# Altium project STM32_PLC.PrjPcb (part 2 of 2)

## Sheet 09_CAN.SchDoc
size 420 x 297 mm; SheetNumber: 9; SheetTotal: 12
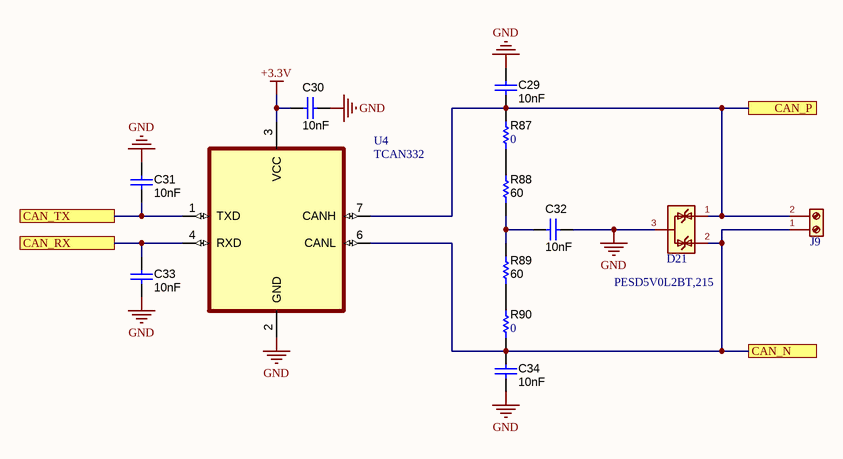
[diagram p4: 09_CAN.SchDoc]

### Parts
C29  ValueDisplayed: 10nF  [0603]  (hidden comment: CAP 10nF 0603)
C30  ValueDisplayed: 10nF  [0603]  (hidden comment: CAP 10nF 0603)
C31  ValueDisplayed: 10nF  [0603]  (hidden comment: CAP 10nF 0603)
C32  ValueDisplayed: 10nF  [0603]  (hidden comment: CAP 10nF 0603)
C33  ValueDisplayed: 10nF  [0603]  (hidden comment: CAP 10nF 0603)
C34  ValueDisplayed: 10nF  [0603]  (hidden comment: CAP 10nF 0603)
D21  PESD5V0L2BT,215  [SOT-23]
J9  Terminal_01x02_P5.00  [TerminalBlock_Phoenix_PT-1,5-2-5.0-H_1x02_P5.00mm_Horizontal]  (value not drawn)
R87  ValueDisplayed: 0  [0402L]  (hidden comment: ERJ-2GE0R00X)
R88  ValueDisplayed: 60  [0603]  (hidden comment: MCT06030Z0000ZP500)
R89  ValueDisplayed: 60  [0603]  (hidden comment: MCT06030Z0000ZP500)
R90  ValueDisplayed: 0  [0402L]  (hidden comment: ERJ-2GE0R00X)
U4  TCAN332  [SOIC127P599X175-8N]

### Ports
CAN_N, CAN_P, CAN_RX (see 04_STM32F373VBTx[6B]), CAN_TX (see 04_STM32F373VBTx[6B])

### Nets
+3.3V: C30.2 U4.3(VCC)
GND: C29.1 C30.1 C31.1 C32.1 C33.2 C34.2 D21.3(A) U4.2(GND)
CAN_N: C34.1 D21.2(K) J9.1(Pin_1) R90.1 U4.6(CANL) ; port CAN_N
CAN_P: C29.2 D21.1(K) J9.2(Pin_2) R87.2 U4.7(CANH) ; port CAN_P
CAN_RX: C33.1 U4.4(RXD) ; port CAN_RX
CAN_TX: C31.2 U4.1(TXD) ; port CAN_TX
NetC32_2: C32.2 R88.1 R89.2
NetR87_1: R87.1 R88.2
NetR89_1: R89.1 R90.2

### Notes on the sheet
- Sub-system:
- Project:
- Design by:
- Sheet title:
- Sheet
- of
- Checked by:
- Approved by:
- Doc No:
- Revision:
- Size:
- Date:
- A3

### Library data of the parts
C29-C34 = CAP 10nF 0603: CAP, CERM, 10 nF, 50 V, +/- 10%, X7R, AEC-Q200 Grade 1, 0603; Manufacturer: MuRata; PartNumber: GCM188R70J225KE22D; TaMin_C: -55°C; Polarized: N; SizeAreaWB_mm2: 4.68; Value1: Unknown; U/M: EA; Value: 2.2uF; TaMax_C: 125°C; SizeZ_mm: 1; SizeX_mm: 1.6; SizeY_mm: 0.8; Value2: 6.3V; SizeArea_mm2: 1.28; CompType: Capacitor; AEC Qualified: Y; Cap_F: 2.2µF; AEC Category: Q200; Supplier Part Number 2: 81-GCM188R70J225KE2D; Publisher: Texas Instruments; Supplier 2: Mouser; TempCo: X7R; Published: 2008-06-19; RoHS: Y; MountType: SMT; Supplier 1: Digi-Key; PackageReference: 0603; Tolerance_%: 10%; Cap_Case: 0603; LatestRevisionDate: 2017-03-09; VDC_V: 6.3V; ComponentLink1Description: Datasheet link; AEC Grade: 1; Supplier Part Number 1: 490-5316-1-ND; Technology: Ceramic; ComponentLink1URL: http://psearch.en.murata.com/capacitor/product/GCM188R70J225KE22%23.pdf
R87 R90 = RES 0R 0402 0.1W: RES, 0, 5%, 0.1 W, AEC-Q200 Grade 0, 0402; Manufacturer: Panasonic; Power_W: 100mW; TempCo: 600 ppm/C; Value_Code: 0000; Value: 0; EIA_Code: E24; SizeX_mm: 1; SizeY_mm: 0.5; SizeZ_mm: 0.6; Value2: 0.1W; CompType: Resistor; AEC Qualified: Y; VDC_V: 50V; AEC Category: Q200; SizeAreaWB_mm2: 3; Supplier Part Number 2: 65T8307; Supplier 2: Newark; Supplier Part Number 3: 667-ERJ-2GE0R00X; Supplier 3: Mouser; RoHS: Y; Value1: 5%; MountType: SMT; Supplier 1: Digi-Key; PackageReference: 0402; Tolerance_%: 5%; Res_ohm: 0; SizeArea_mm2: 0.5; PartNumber: ERJ-2GE0R00X; ComponentLink1Description: Datasheet link; Supplier Part Number 1: P0.0JCT-ND; Technology: Thick Film; ComponentLink1URL: https://industrial.panasonic.com/cdbs/www-data/pdf/RDA0000/AOA0000C301.pdf; AEC Grade: 0
R88 R89 = RES 60R 0603: RES, 60, 5%, 0.125 W, 0603; Manufacturer: Vishay/Beyschlag; Power_W: 125mW; TempCo: ppm/C; Value_Code: 0000; U/M: EA; Value: 0; EIA_Code: E24; SizeX_mm: 1.6; SizeY_mm: 0.8; SizeZ_mm: 1; Value2: 0.125W; SizeArea_mm2: 1.28; CompType: Resistor; AEC Qualified: N; AEC Category: Q200; Supplier Part Number 2: 96Y9454; Publisher: Texas Instruments; Supplier 2: Newark; Supplier Part Number 3: 594-MCT06030Z0000ZP5; Supplier 3: Mouser; Published: 2008-06-26; RoHS: Y; Value1: 5%; MountType: SMT; Supplier 1: Digi-Key; PackageReference: 0603; Tolerance_%: 5%; Res_ohm: 0; LatestRevisionDate: 2017-03-09; PartNumber: MCT06030Z0000ZP500; ComponentLink1Description: Datasheet link; AEC Grade: N/A; Supplier Part Number 1: MCT0603-0.0-ZZCT-ND; Technology: Thin Film; ComponentLink1URL: http://www.vishay.com/docs/28705/mcx0x0xpro.pdf
U4 = TCAN332DR: 3.3-V CAN Transceivers; MF: Texas Instruments; SnapEDA_Link: https://www.snapeda.com/parts/TCAN332DR/Texas+Instruments/view-part/?ref=snap; Package: SOIC-8 Texas Instruments; Value: *; MP: TCAN332DR; Check_prices: https://www.snapeda.com/parts/TCAN332DR/Texas+Instruments/view-part/?ref=eda

## Sheet 10_SDADC.SchDoc
size 420 x 297 mm; SheetNumber: 10; SheetTotal: 12
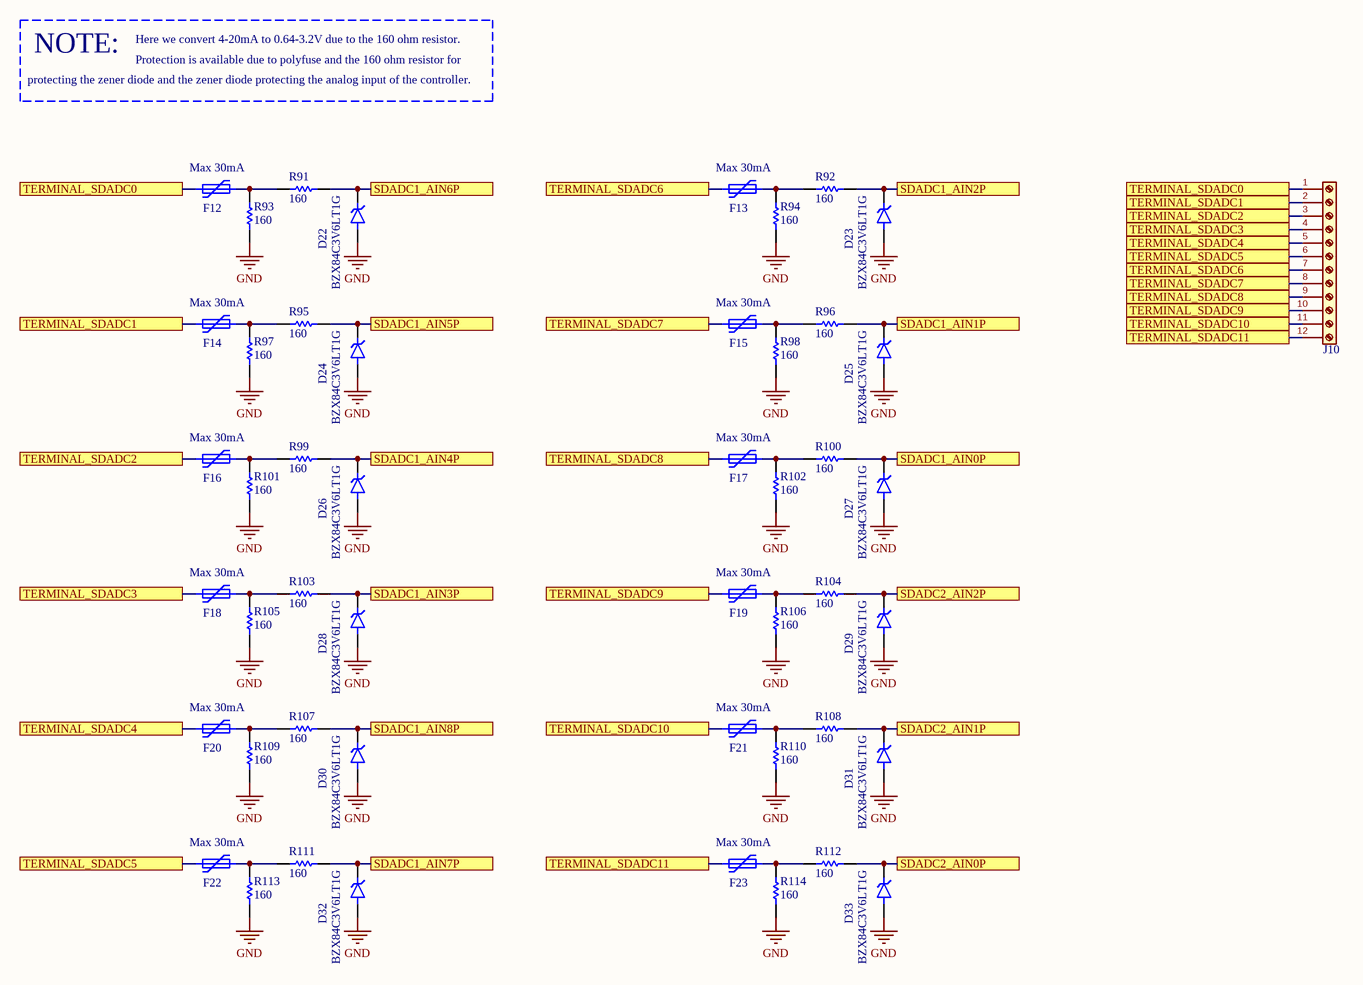
[diagram p5: 10_SDADC.SchDoc]

### Parts
D22  BZX84C3V6LT1G  [SOT95P240X111-3N]
D23  BZX84C3V6LT1G  [SOT95P240X111-3N]
D24  BZX84C3V6LT1G  [SOT95P240X111-3N]
D25  BZX84C3V6LT1G  [SOT95P240X111-3N]
D26  BZX84C3V6LT1G  [SOT95P240X111-3N]
D27  BZX84C3V6LT1G  [SOT95P240X111-3N]
D28  BZX84C3V6LT1G  [SOT95P240X111-3N]
D29  BZX84C3V6LT1G  [SOT95P240X111-3N]
D30  BZX84C3V6LT1G  [SOT95P240X111-3N]
D31  BZX84C3V6LT1G  [SOT95P240X111-3N]
D32  BZX84C3V6LT1G  [SOT95P240X111-3N]
D33  BZX84C3V6LT1G  [SOT95P240X111-3N]
F12  Max 30mA  [Fuse_0603_1608Metric]
F13  Max 30mA  [Fuse_0603_1608Metric]
F14  Max 30mA  [Fuse_0603_1608Metric]
F15  Max 30mA  [Fuse_0603_1608Metric]
F16  Max 30mA  [Fuse_0603_1608Metric]
F17  Max 30mA  [Fuse_0603_1608Metric]
F18  Max 30mA  [Fuse_0603_1608Metric]
F19  Max 30mA  [Fuse_0603_1608Metric]
F20  Max 30mA  [Fuse_0603_1608Metric]
F21  Max 30mA  [Fuse_0603_1608Metric]
F22  Max 30mA  [Fuse_0603_1608Metric]
F23  Max 30mA  [Fuse_0603_1608Metric]
J10  Terminal_01x12_P5.00  [TerminalBlock_Phoenix_PT-1,5-12-5.0-H_1x12_P5.00mm_Horizontal]  (value not drawn)
R91  ValueDisplayed: 160  [0603]  (hidden comment: CRCW060320R0JNEA)
R92  ValueDisplayed: 160  [0603]  (hidden comment: CRCW060320R0JNEA)
R93  ValueDisplayed: 160  [0603]  (hidden comment: CRCW060320R0JNEA)
R94  ValueDisplayed: 160  [0603]  (hidden comment: CRCW060320R0JNEA)
R95  ValueDisplayed: 160  [0603]  (hidden comment: CRCW060320R0JNEA)
R96  ValueDisplayed: 160  [0603]  (hidden comment: CRCW060320R0JNEA)
R97  ValueDisplayed: 160  [0603]  (hidden comment: CRCW060320R0JNEA)
R98  ValueDisplayed: 160  [0603]  (hidden comment: CRCW060320R0JNEA)
R99  ValueDisplayed: 160  [0603]  (hidden comment: CRCW060320R0JNEA)
R100  ValueDisplayed: 160  [0603]  (hidden comment: CRCW060320R0JNEA)
R101  ValueDisplayed: 160  [0603]  (hidden comment: CRCW060320R0JNEA)
R102  ValueDisplayed: 160  [0603]  (hidden comment: CRCW060320R0JNEA)
R103  ValueDisplayed: 160  [0603]  (hidden comment: CRCW060320R0JNEA)
R104  ValueDisplayed: 160  [0603]  (hidden comment: CRCW060320R0JNEA)
R105  ValueDisplayed: 160  [0603]  (hidden comment: CRCW060320R0JNEA)
R106  ValueDisplayed: 160  [0603]  (hidden comment: CRCW060320R0JNEA)
R107  ValueDisplayed: 160  [0603]  (hidden comment: CRCW060320R0JNEA)
R108  ValueDisplayed: 160  [0603]  (hidden comment: CRCW060320R0JNEA)
R109  ValueDisplayed: 160  [0603]  (hidden comment: CRCW060320R0JNEA)
R110  ValueDisplayed: 160  [0603]  (hidden comment: CRCW060320R0JNEA)
R111  ValueDisplayed: 160  [0603]  (hidden comment: CRCW060320R0JNEA)
R112  ValueDisplayed: 160  [0603]  (hidden comment: CRCW060320R0JNEA)
R113  ValueDisplayed: 160  [0603]  (hidden comment: CRCW060320R0JNEA)
R114  ValueDisplayed: 160  [0603]  (hidden comment: CRCW060320R0JNEA)

### Ports
SDADC1_AIN0P (see 04_STM32F373VBTx[5C]), SDADC1_AIN1P (see 04_STM32F373VBTx[5C]), SDADC1_AIN2P (see 04_STM32F373VBTx[5C]), SDADC1_AIN3P (see 04_STM32F373VBTx[5C]), SDADC1_AIN4P (see 04_STM32F373VBTx[6B]), SDADC1_AIN5P (see 04_STM32F373VBTx[6B]), SDADC1_AIN6P (see 04_STM32F373VBTx[6B]), SDADC1_AIN7P (see 04_STM32F373VBTx[5C]), SDADC1_AIN8P (see 04_STM32F373VBTx[5C]), SDADC2_AIN0P (see 04_STM32F373VBTx[5C]), SDADC2_AIN1P (see 04_STM32F373VBTx[5C]), SDADC2_AIN2P (see 04_STM32F373VBTx[5C]), TERMINAL_SDADC0 (see 10_SDADC[1A]), TERMINAL_SDADC0 (see 10_SDADC[4A]), TERMINAL_SDADC1 (see 10_SDADC[1A]), TERMINAL_SDADC1 (see 10_SDADC[4A]), TERMINAL_SDADC2 (see 10_SDADC[1B]), TERMINAL_SDADC2 (see 10_SDADC[4A]), TERMINAL_SDADC3 (see 10_SDADC[1B]), TERMINAL_SDADC3 (see 10_SDADC[4A]), TERMINAL_SDADC4 (see 10_SDADC[1B]), TERMINAL_SDADC4 (see 10_SDADC[4A]), TERMINAL_SDADC5 (see 10_SDADC[1C]), TERMINAL_SDADC5 (see 10_SDADC[4A]), TERMINAL_SDADC6 (see 10_SDADC[2A]), TERMINAL_SDADC6 (see 10_SDADC[4A]), TERMINAL_SDADC7 (see 10_SDADC[2A]), TERMINAL_SDADC7 (see 10_SDADC[4A]), TERMINAL_SDADC8 (see 10_SDADC[2B]), TERMINAL_SDADC8 (see 10_SDADC[4A]), TERMINAL_SDADC9 (see 10_SDADC[2B]), TERMINAL_SDADC9 (see 10_SDADC[4A]), TERMINAL_SDADC10 (see 10_SDADC[2B]), TERMINAL_SDADC10 (see 10_SDADC[4A]), TERMINAL_SDADC11 (see 10_SDADC[2C]), TERMINAL_SDADC11 (see 10_SDADC[4A])

### Nets
GND: D22.1(A) D23.1(A) D24.1(A) D25.1(A) D26.1(A) D27.1(A) D28.1(A) D29.1(A) D30.1(A) D31.1(A) D32.1(A) D33.1(A) R93.1 R94.1 R97.1 R98.1 R101.1 R102.1 R105.1 R106.1 R109.1 R110.1 R113.1 R114.1
SDADC1_AIN0P: D27.3(K) R100.2 ; port SDADC1_AIN0P
SDADC1_AIN1P: D25.3(K) R96.2 ; port SDADC1_AIN1P
SDADC1_AIN2P: D23.3(K) R92.2 ; port SDADC1_AIN2P
SDADC1_AIN3P: D28.3(K) R103.2 ; port SDADC1_AIN3P
SDADC1_AIN4P: D26.3(K) R99.2 ; port SDADC1_AIN4P
SDADC1_AIN5P: D24.3(K) R95.2 ; port SDADC1_AIN5P
SDADC1_AIN6P: D22.3(K) R91.2 ; port SDADC1_AIN6P
SDADC1_AIN7P: D32.3(K) R111.2 ; port SDADC1_AIN7P
SDADC1_AIN8P: D30.3(K) R107.2 ; port SDADC1_AIN8P
SDADC2_AIN0P: D33.3(K) R112.2 ; port SDADC2_AIN0P
SDADC2_AIN1P: D31.3(K) R108.2 ; port SDADC2_AIN1P
SDADC2_AIN2P: D29.3(K) R104.2 ; port SDADC2_AIN2P
TERMINAL_SDADC0: F12.1 J10.1(Pin_1) ; port TERMINAL_SDADC0
TERMINAL_SDADC1: F14.1 J10.2(Pin_2) ; port TERMINAL_SDADC1
TERMINAL_SDADC2: F16.1 J10.3(Pin_3) ; port TERMINAL_SDADC2
TERMINAL_SDADC3: F18.1 J10.4(Pin_4) ; port TERMINAL_SDADC3
TERMINAL_SDADC4: F20.1 J10.5(Pin_5) ; port TERMINAL_SDADC4
TERMINAL_SDADC5: F22.1 J10.6(Pin_6) ; port TERMINAL_SDADC5
TERMINAL_SDADC6: F13.1 J10.7(Pin_7) ; port TERMINAL_SDADC6
TERMINAL_SDADC7: F15.1 J10.8(Pin_8) ; port TERMINAL_SDADC7
TERMINAL_SDADC8: F17.1 J10.9(Pin_9) ; port TERMINAL_SDADC8
TERMINAL_SDADC9: F19.1 J10.10(Pin_10) ; port TERMINAL_SDADC9
TERMINAL_SDADC10: F21.1 J10.11(Pin_11) ; port TERMINAL_SDADC10
TERMINAL_SDADC11: F23.1 J10.12(Pin_12) ; port TERMINAL_SDADC11
NetF12_2: F12.2 R91.1 R93.2
NetF13_2: F13.2 R92.1 R94.2
NetF14_2: F14.2 R95.1 R97.2
NetF15_2: F15.2 R96.1 R98.2
NetF16_2: F16.2 R99.1 R101.2
NetF17_2: F17.2 R100.1 R102.2
NetF18_2: F18.2 R103.1 R105.2
NetF19_2: F19.2 R104.1 R106.2
NetF20_2: F20.2 R107.1 R109.2
NetF21_2: F21.2 R108.1 R110.2
NetF22_2: F22.2 R111.1 R113.2
NetF23_2: F23.2 R112.1 R114.2

### Notes on the sheet
- protecting the zener diode and the zener diode protecting the analog input of the controller.
- NOTE:
- Here we convert 4-20mA to 0.64-3.2V due to the 160 ohm resistor.
- Protection is available due to polyfuse and the 160 ohm resistor for
- Sub-system:
- Project:
- Design by:
- Sheet title:
- Sheet
- of
- Checked by:
- Approved by:
- Doc No:
- Revision:
- Size:
- Date:
- A3

### Library data of the parts
D22-D33 = BZX84C3V6LT1G: MP: BZX84C10LT1G; Package: None; Price: None; Value: *; Availability: Unavailable
F12-F23 = Polyfuse 0603
R91-R114 = RES 160R 0603: RES, 160, 5%, 0.1 W, AEC-Q200 Grade 0, 0603; Manufacturer: Vishay-Dale; Power_W: 100mW; TempCo: 200 ppm/C; Value_Code: 20R0; Value: 20; EIA_Code: E24; SizeX_mm: 1.6; SizeY_mm: 0.8; SizeZ_mm: 1; Value2: 0.1W; SizeArea_mm2: 1.28; CompType: Resistor; AEC Qualified: Y; VDC_V: 75V; AEC Category: Q200; AEC Grade: 0; Supplier Part Number 2: 59M6784; Supplier 2: Newark; Supplier Part Number 3: 71-CRCW0603J-20-E3; Supplier 3: Mouser; RoHS: E; Value1: 5%; MountType: SMT; Supplier 1: Digi-Key; PackageReference: 0603; Tolerance_%: 5%; Res_ohm: 20; PartNumber: CRCW060320R0JNEA; ComponentLink1Description: Datasheet link; Supplier Part Number 1: 541-20GCT-ND; Technology: Thick Film; ComponentLink1URL: http://www.vishay.com/docs/20035/dcrcwe3.pdf

## Sheet 11_DAC.SchDoc
size 420 x 297 mm; SheetNumber: 11; SheetTotal: 12
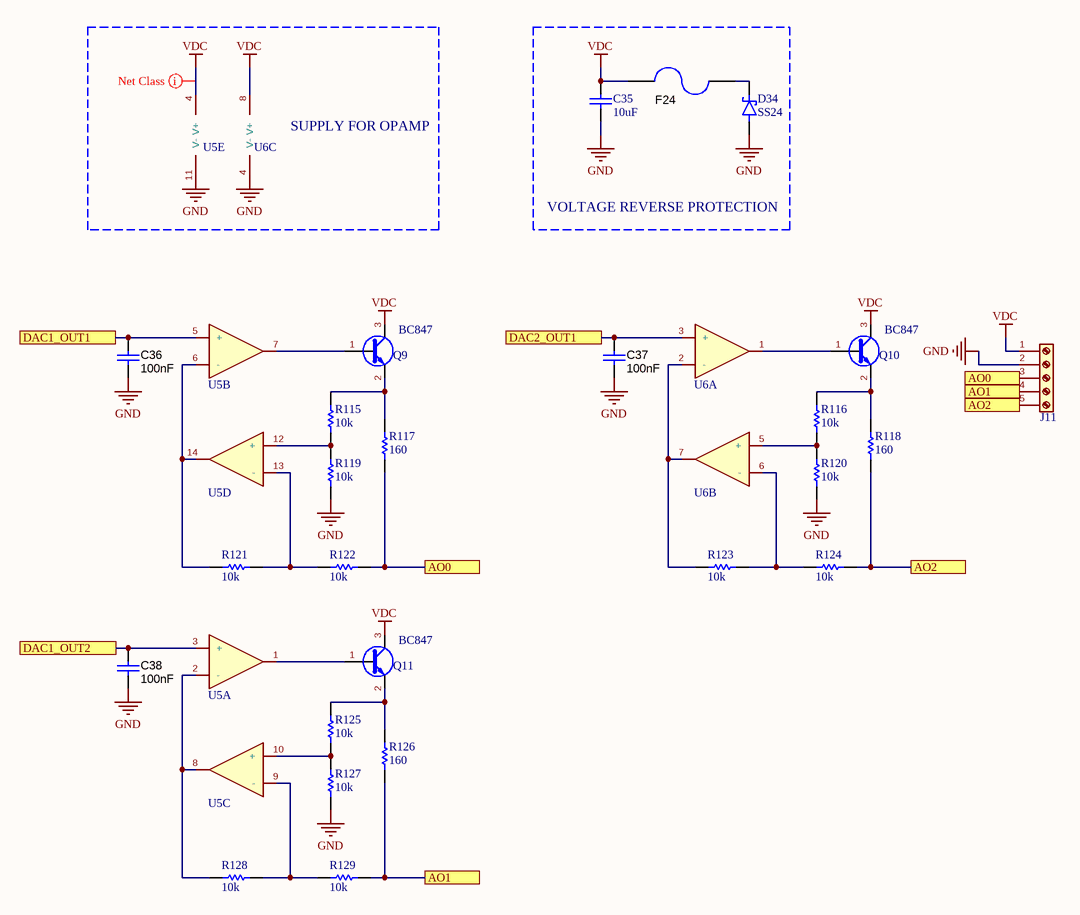
[diagram p6: 11_DAC.SchDoc]

### Parts
C35  ValueDisplayed: 10uF  [C_1206_3216Metric]  (hidden comment: CGA6P1X7R1E106M250AC)
C36  ValueDisplayed: 100nF  [0603]  (hidden comment: CAP 100nF 0603)
C37  ValueDisplayed: 100nF  [0603]  (hidden comment: CAP 100nF 0603)
C38  ValueDisplayed: 100nF  [0603]  (hidden comment: CAP 100nF 0603)
D34  SS24  [DIOM5336X265N]
F24  0440005.WR  [CAPC4520X203N]  (value not drawn)
J11  Terminal_01x5_P5.00  [TerminalBlock_Phoenix_PT-1,5-5-5.0-H_1x5_P5.00mm_Horizontal]  (value not drawn)
Q9  BC847  [SOT-23]
Q10  BC847  [SOT-23]
Q11  BC847  [SOT-23]
R115  ValueDisplayed: 10k  [0603]  (hidden comment: RES 10K 0603)
R116  ValueDisplayed: 10k  [0603]  (hidden comment: RES 10K 0603)
R117  ValueDisplayed: 160  [0603]  (hidden comment: CRCW060320R0JNEA)
R118  ValueDisplayed: 160  [0603]  (hidden comment: CRCW060320R0JNEA)
R119  ValueDisplayed: 10k  [0603]  (hidden comment: RES 10K 0603)
R120  ValueDisplayed: 10k  [0603]  (hidden comment: RES 10K 0603)
R121  ValueDisplayed: 10k  [0603]  (hidden comment: RES 10K 0603)
R122  ValueDisplayed: 10k  [0603]  (hidden comment: RES 10K 0603)
R123  ValueDisplayed: 10k  [0603]  (hidden comment: RES 10K 0603)
R124  ValueDisplayed: 10k  [0603]  (hidden comment: RES 10K 0603)
R125  ValueDisplayed: 10k  [0603]  (hidden comment: RES 10K 0603)
R126  ValueDisplayed: 160  [0603]  (hidden comment: CRCW060320R0JNEA)
R127  ValueDisplayed: 10k  [0603]  (hidden comment: RES 10K 0603)
R128  ValueDisplayed: 10k  [0603]  (hidden comment: RES 10K 0603)
R129  ValueDisplayed: 10k  [0603]  (hidden comment: RES 10K 0603)
U5  LM2902  [SOIC-14_3.9x8.7mm_P1.27mm]  (value not drawn)  (parts A,B,C,D,E of 5)
U6  LM2904  [SOIC-8_3.9x4.9mm_P1.27mm]  (value not drawn)  (parts A,B,C of 3)

### Blocks framed on the sheet
SUPPLY FOR OPAMP: U5 U6
VOLTAGE REVERSE PROTECTION: C35 D34 F24

### Ports
AO0 (see 11_DAC[2B]), AO0 (see 11_DAC[3B]), AO1 (see 11_DAC[2C]), AO1 (see 11_DAC[3B]), AO2 (see 11_DAC[3B]), DAC1_OUT1 (see 04_STM32F373VBTx[5B]), DAC1_OUT2 (see 04_STM32F373VBTx[5B]), DAC2_OUT1 (see 04_STM32F373VBTx[5B])

### Nets
GND: C35.2 C36.2 C37.2 C38.2 D34.A J11.2(Pin_2) R119.1 R120.1 R127.1 U5.11(V-) U6.4(V-)
VDC: C35.1 F24.2 J11.1(Pin_1) Q9.3(C) Q10.3(C) Q11.3(C) U5.4(V+) U6.8(V+)
AO0: J11.3(Pin_3) R117.1 R122.2 ; port AO0
AO1: J11.4(Pin_4) R126.1 R129.2 ; port AO1
AO2: J11.5(Pin_5) R118.1 R124.2 ; port AO2
DAC1_OUT1: C36.1 U5.5(+) ; port DAC1_OUT1
DAC1_OUT2: C38.1 U5.3(+) ; port DAC1_OUT2
DAC2_OUT1: C37.1 U6.3(+) ; port DAC2_OUT1
NetD34_C: D34.C(K) F24.1
NetQ9_1: Q9.1(B) U5.7
NetQ9_2: Q9.2(E) R115.2 R117.2
NetQ10_1: Q10.1(B) U6.1
NetQ10_2: Q10.2(E) R116.2 R118.2
NetQ11_1: Q11.1(B) U5.1
NetQ11_2: Q11.2(E) R125.2 R126.2
NetR115_1: R115.1 R119.2 U5.12(+)
NetR116_1: R116.1 R120.2 U6.5(+)
NetR121_1: R121.1 U5.6(-) U5.14
NetR121_2: R121.2 R122.1 U5.13(-)
NetR123_1: R123.1 U6.2(-) U6.7
NetR123_2: R123.2 R124.1 U6.6(-)
NetR125_1: R125.1 R127.2 U5.10(+)
NetR128_1: R128.1 U5.2(-) U5.8
NetR128_2: R128.2 R129.1 U5.9(-)

### Layout directives
net class PWR: VDC

### Notes on the sheet
- Sub-system:
- Project:
- Design by:
- Sheet title:
- Sheet
- of
- Checked by:
- Approved by:
- Doc No:
- Revision:
- Size:
- Date:
- A3

### Library data of the parts
C35 = CAP 10uF 1206: Manufacturer: TDK; TaMin_C: -55°C; Polarized: N; TempCo: X7R; SizeAreaWB_mm2: 14.7; Value1: Unknown; U/M: EA; Value: 10uF; TaMax_C: 125°C; Tolerance_%: 20%; SizeZ_mm: 2.8; SizeX_mm: 3.2; SizeY_mm: 2.5; Cap_Case: 1210; Value2: 25V; SizeArea_mm2: 8; CompType: Capacitor; AEC Qualified: Y; Cap_F: 10µF; AEC Grade: 1; AEC Category: Q200; Supplier Part Number 2: 810-CGA6P1X7R1E106M; Publisher: Texas Instruments; Supplier 2: Mouser; Published: 2008-06-19; RoHS: Y; MountType: SMT; Supplier 1: Digi-Key; PackageReference: 1210; LatestRevisionDate: 2017-03-09; PartNumber: CGA6P1X7R1E106M250AC; VDC_V: 25V; ComponentLink1Description: Datasheet link; Supplier Part Number 1: 445-5720-1-ND; Technology: Ceramic; ComponentLink1URL: http://product.tdk.com/en/catalog/datasheets/mlcc_automotive_general_en.pdf
C36-C38 = CAP 100nF 0603: CAP, CERM, 100 nF, 25 V, +/- 10%, X7R, AEC-Q200 Grade 1, 0603; Manufacturer: MuRata; PartNumber: GCM188R70J225KE22D; TaMin_C: -55°C; Polarized: N; SizeAreaWB_mm2: 4.68; Value1: Unknown; U/M: EA; Value: 2.2uF; TaMax_C: 125°C; SizeZ_mm: 1; SizeX_mm: 1.6; SizeY_mm: 0.8; Value2: 6.3V; SizeArea_mm2: 1.28; CompType: Capacitor; AEC Qualified: Y; Cap_F: 2.2µF; AEC Category: Q200; Supplier Part Number 2: 81-GCM188R70J225KE2D; Publisher: Texas Instruments; Supplier 2: Mouser; TempCo: X7R; Published: 2008-06-19; RoHS: Y; MountType: SMT; Supplier 1: Digi-Key; PackageReference: 0603; Tolerance_%: 10%; Cap_Case: 0603; LatestRevisionDate: 2017-03-09; VDC_V: 6.3V; ComponentLink1Description: Datasheet link; AEC Grade: 1; Supplier Part Number 1: 490-5316-1-ND; Technology: Ceramic; ComponentLink1URL: http://psearch.en.murata.com/capacitor/product/GCM188R70J225KE22%23.pdf
D34 = SS24: Diode Schottky 40V 2A Surface Mount DO-214AA (SMB); MF: ON Semiconductor; Package: DO-214AA ON Semiconductor; Price: None; Value: *; SnapEDA_Link: https://www.snapeda.com/parts/SS24/Onsemi/view-part/?ref=snap; MP: SS24; Availability: In Stock; Check_prices: https://www.snapeda.com/parts/SS24/Onsemi/view-part/?ref=eda
F24 = FUSE 1808: Fuse, 5 A, 32VAC/VDC, SMD; Manufacturer: Littelfuse; Irating_A: 5A; SizeAreaWB_mm2: 10.92; Interrupt_AC: 50A; VAC_V: 32V; SizeZ_mm: 1.35; SizeX_mm: 3.2; SizeY_mm: 1.6; SizeArea_mm2: 5.12; Rtyp_Ohm: 0.012; MeltingTyp: 4.761; ComponentLink1URL: http://www.littelfuse.com/~/media/electronics/datasheets/fuses/littelfuse_fuse_440_datasheet.pdf.pdf; Supplier Part Number 2: 64R8013; Supplier 2: Newark; Supplier Part Number 3: 576-0440005.WR; Supplier 3: Mouser; RoHS: Y; MountType: SMT; Interrupt_DC: 50A; Supplier 1: Digi-Key; PackageReference: 1206; CompType: Fuse; PartNumber: 0440005.WR; VDC_V: 32V; ComponentLink1Description: Datasheet URL; Supplier Part Number 1: F1608CT-ND
R115 R116 R119-R125 R127-R129 = RES 10K 0603 1%: RES, 10K, 1%, 0.1 W, AEC-Q200 Grade 0, 0603; Manufacturer: Vishay-Dale; PartNumber: CRCW060320R0JNEA; Power_W: 100mW; TempCo: 200 ppm/C; Value_Code: 20R0; Value1: 5%; Value: 20; EIA_Code: E24; SizeX_mm: 1.6; SizeY_mm: 0.8; SizeZ_mm: 1; Value2: 0.1W; SizeArea_mm2: 1.28; CompType: Resistor; AEC Qualified: Y; VDC_V: 75V; AEC Category: Q200; AEC Grade: 0; Supplier Part Number 2: 59M6784; Supplier 2: Newark; Supplier Part Number 3: 71-CRCW0603J-20-E3; Supplier 3: Mouser; RoHS: E; MountType: SMT; Supplier 1: Digi-Key; PackageReference: 0603; Tolerance_%: 5%; Res_ohm: 20; ComponentLink1Description: Datasheet link; Supplier Part Number 1: 541-20GCT-ND; Technology: Thick Film; ComponentLink1URL: http://www.vishay.com/docs/20035/dcrcwe3.pdf
R117 R118 R126 = RES 160R 0603: as R91 on sheet 10_SDADC; Supplier Part Number 2: 59M6784; Supplier 2: Newark; Supplier Part Number 3: 71-CRCW0603J-20-E3; Supplier 3: Mouser; RoHS: E; Value1: 5%; MountType: SMT; Supplier 1: Digi-Key; PackageReference: 0603; Tolerance_%: 5%; Res_ohm: 20; PartNumber: CRCW060320R0JNEA; ComponentLink1Description: Datasheet link; Supplier Part Number 1: 541-20GCT-ND; Technology: Thick Film; ComponentLink1URL: http://www.vishay.com/docs/20035/dcrcwe3.pdf

## Sheet 12_LED.SchDoc
size 420 x 297 mm; SheetNumber: 12; SheetTotal: 12
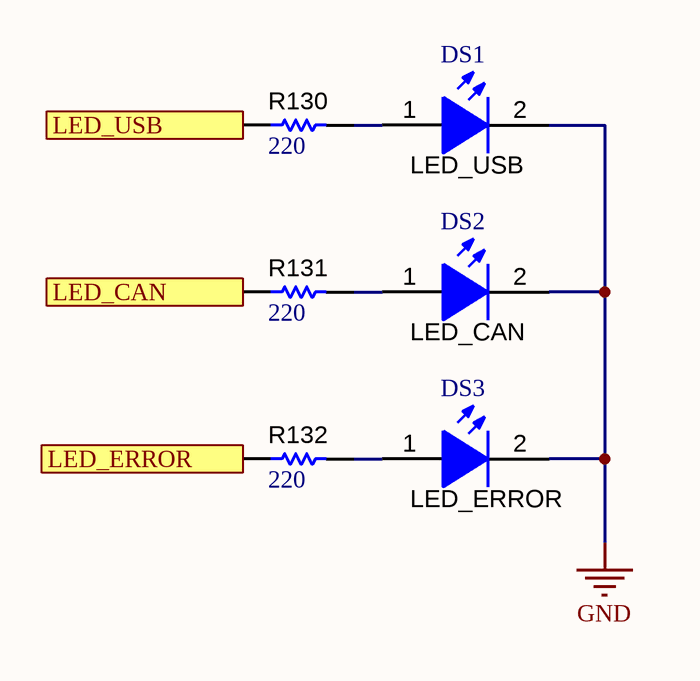
[diagram p7: 12_LED.SchDoc]

### Parts
DS1  value LED_USB  [LS L29K_Red]  (hidden comment: LS L29K-G1J2-1-Z)
DS2  value LED_CAN  [LS L29K_Red]  (hidden comment: LS L29K-G1J2-1-Z)
DS3  value LED_ERROR  [LS L29K_Red]  (hidden comment: LS L29K-G1J2-1-Z)
R130  ValueDisplayed: 220  [0402L]  (hidden comment: CRCW04021K00FKED)
R131  ValueDisplayed: 220  [0402L]  (hidden comment: CRCW04021K00FKED)
R132  ValueDisplayed: 220  [0402L]  (hidden comment: CRCW04021K00FKED)

### Ports
LED_CAN (see 04_STM32F373VBTx[5B]), LED_ERROR (see 04_STM32F373VBTx[5B]), LED_USB (see 04_STM32F373VBTx[5B])

### Nets
GND: DS1.2(K) DS2.2(K) DS3.2(K)
LED_CAN: R131.1 ; port LED_CAN
LED_ERROR: R132.1 ; port LED_ERROR
LED_USB: R130.1 ; port LED_USB
NetDS1_1: DS1.1(A) R130.2
NetDS2_1: DS2.1(A) R131.2
NetDS3_1: DS3.1(A) R132.2

### Notes on the sheet
- Sub-system:
- Project:
- Design by:
- Sheet title:
- Sheet
- of
- Checked by:
- Approved by:
- Doc No:
- Revision:
- Size:
- Date:
- A3

### Library data of the parts
DS1-DS3 = LED RED SMD: LED, Red, SMD; Manufacturer: OSRAM; Io_A: 20mA; Vr_V: 12V; Tjmax_C: 110°C; Value1: W; Angle: 160; Vf_V: 1.8V; ComponentLink1URL: http://www.osram-os.com/Graphics/XPic2/00077099_0.pdf; Color: Red; RoHS: Y; MountType: SMT; PackageReference: SMD, 2-Leads, Body 1.3x0.8mm; Value2: 1.8V; CompType: LED; Type: ?; PartNumber: LS L29K-G1J2-1-Z; ComponentLink1Description: Datasheet link
R130-R132 = RES 1K 0402: RES, 1.00 k, 1%, 0.063 W, AEC-Q200 Grade 0, 0402; Manufacturer: Vishay-Dale; Power_W: 63mW; TempCo: 100 ppm/C; Value_Code: 1k00; Value: 1.00k; EIA_Code: E96; Res_ohm: 1k; SizeX_mm: 1; SizeY_mm: 0.5; SizeZ_mm: 0.6; Value2: 0.063W; CompType: Resistor; AEC Qualified: Y; VDC_V: 50V; AEC Category: Q200; AEC Grade: 0; Supplier Part Number 2: 52K6545; Supplier 2: Newark; Supplier Part Number 3: 71-CRCW0402-1.0K-E3; Supplier 3: Mouser; RoHS: E; Value1: 1%; MountType: SMT; Supplier 1: Digi-Key; PackageReference: 0402; Tolerance_%: 1%; SizeArea_mm2: 0.5; PartNumber: CRCW04021K00FKED; ComponentLink1Description: Datasheet link; Supplier Part Number 1: 541-1.00KLCT-ND; Technology: Thick Film; ComponentLink1URL: http://www.vishay.com/docs/20035/dcrcwe3.pdf

## Nets that join several sheets
+3.3V: 04_STM32F373VBTx (33 pins), 08_INPUTCAPTURE_ENCODER (12 pins), 09_CAN (C30.2 U4.3)
+5V: 04_STM32F373VBTx (6 pins), 06_DIGITAL (24 pins)
GND: 04_STM32F373VBTx (51 pins), 06_DIGITAL (24 pins), 07_SDDADC (20 pins), 08_INPUTCAPTURE_ENCODER (24 pins), 09_CAN (8 pins), 10_SDADC (24 pins), 11_DAC (11 pins), 12_LED (DS1.2 DS2.2 DS3.2)
CAN_RX: 04_STM32F373VBTx (U1.81), 09_CAN (C33.1 U4.4)
CAN_TX: 04_STM32F373VBTx (U1.82), 09_CAN (C31.2 U4.1)
DAC1_OUT1: 04_STM32F373VBTx (U1.29), 11_DAC (C36.1 U5.5)
DAC1_OUT2: 04_STM32F373VBTx (U1.30), 11_DAC (C38.1 U5.3)
DAC2_OUT1: 04_STM32F373VBTx (U1.31), 11_DAC (C37.1 U6.3)
DO0: 04_STM32F373VBTx (U1.15), 06_DIGITAL (R23.2)
DO1: 04_STM32F373VBTx (U1.16), 06_DIGITAL (R29.2)
DO2: 04_STM32F373VBTx (U1.17), 06_DIGITAL (R35.2)
DO3: 04_STM32F373VBTx (U1.18), 06_DIGITAL (R41.2)
DO4: 04_STM32F373VBTx (U1.23), 06_DIGITAL (R24.2)
DO5: 04_STM32F373VBTx (U1.24), 06_DIGITAL (R30.2)
DO6: 04_STM32F373VBTx (U1.68), 06_DIGITAL (R36.2)
DO7: 04_STM32F373VBTx (U1.69), 06_DIGITAL (R42.2)
E0+: 04_STM32F373VBTx (U1.93), 08_INPUTCAPTURE_ENCODER (U3.2)
E0-: 04_STM32F373VBTx (U1.92), 08_INPUTCAPTURE_ENCODER (U3.12)
E1+: 04_STM32F373VBTx (U1.79), 08_INPUTCAPTURE_ENCODER (U3.4)
E1-: 04_STM32F373VBTx (U1.78), 08_INPUTCAPTURE_ENCODER (U3.10)
E2+: 04_STM32F373VBTx (U1.64), 08_INPUTCAPTURE_ENCODER (U3.6)
E2-: 04_STM32F373VBTx (U1.63), 08_INPUTCAPTURE_ENCODER (U3.8)
IC0: 04_STM32F373VBTx (U1.96), 08_INPUTCAPTURE_ENCODER (U2.2)
IC1: 04_STM32F373VBTx (U1.95), 08_INPUTCAPTURE_ENCODER (U2.4)
IC2: 04_STM32F373VBTx (U1.25), 08_INPUTCAPTURE_ENCODER (U2.6)
IC3: 04_STM32F373VBTx (U1.26), 08_INPUTCAPTURE_ENCODER (U2.8)
LED_CAN: 04_STM32F373VBTx (U1.33), 12_LED (R131.1)
LED_ERROR: 04_STM32F373VBTx (U1.34), 12_LED (R132.1)
LED_USB: 04_STM32F373VBTx (U1.32), 12_LED (R130.1)
SDADC1_AIN0P: 04_STM32F373VBTx (U1.43), 10_SDADC (D27.3 R100.2)
SDADC1_AIN1P: 04_STM32F373VBTx (U1.42), 10_SDADC (D25.3 R96.2)
SDADC1_AIN2P: 04_STM32F373VBTx (U1.41), 10_SDADC (D23.3 R92.2)
SDADC1_AIN3P: 04_STM32F373VBTx (U1.38), 10_SDADC (D28.3 R103.2)
SDADC1_AIN4P: 04_STM32F373VBTx (U1.37), 10_SDADC (D26.3 R99.2)
SDADC1_AIN5P: 04_STM32F373VBTx (U1.36), 10_SDADC (D24.3 R95.2)
SDADC1_AIN6P: 04_STM32F373VBTx (U1.35), 10_SDADC (D22.3 R91.2)
SDADC1_AIN7P: 04_STM32F373VBTx (U1.40), 10_SDADC (D32.3 R111.2)
SDADC1_AIN8P: 04_STM32F373VBTx (U1.39), 10_SDADC (D30.3 R107.2)
SDADC2_AIN0P: 04_STM32F373VBTx (U1.46), 10_SDADC (D33.3 R112.2)
SDADC2_AIN1P: 04_STM32F373VBTx (U1.45), 10_SDADC (D31.3 R108.2)
SDADC2_AIN2P: 04_STM32F373VBTx (U1.44), 10_SDADC (D29.3 R104.2)
SDADC3_AIN0M: 04_STM32F373VBTx (U1.62), 07_SDDADC (D18.3 R60.2)
SDADC3_AIN0P: 04_STM32F373VBTx (U1.61), 07_SDDADC (D16.3 R56.2)
SDADC3_AIN2M: 04_STM32F373VBTx (U1.60), 07_SDDADC (D14.3 R52.2)
SDADC3_AIN2P: 04_STM32F373VBTx (U1.59), 07_SDDADC (D12.3 R48.2)
SDADC3_AIN4M: 04_STM32F373VBTx (U1.58), 07_SDDADC (D20.3 R65.2)
SDADC3_AIN4P: 04_STM32F373VBTx (U1.57), 07_SDDADC (D19.3 R63.2)
SDADC3_AIN6M: 04_STM32F373VBTx (U1.56), 07_SDDADC (D17.3 R59.2)
SDADC3_AIN6P: 04_STM32F373VBTx (U1.55), 07_SDDADC (D15.3 R55.2)
SDADC3_AIN8M: 04_STM32F373VBTx (U1.54), 07_SDDADC (D13.3 R51.2)
SDADC3_AIN8P: 04_STM32F373VBTx (U1.53), 07_SDDADC (D11.3 R47.2)